# Altium schematic sheet BNO_055_Avionics_board.SchDoc: BNO 055 - Avionics Board
size A4; Author: Adam R. Lehman; SheetNumber: 2; SheetTotal: 5
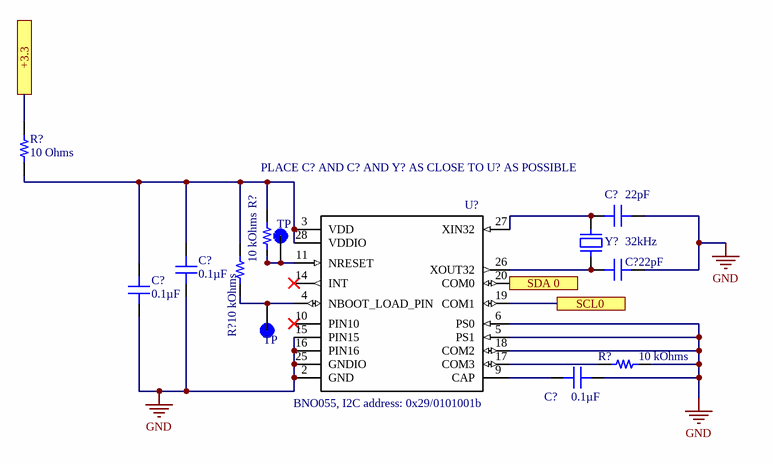
[diagram p0: BNO_055_Avionics_board.SchDoc]

## Parts
(Parts that share a designator on the sheet are numbered #1, #2 ... from top to bottom, then left to right.)
C?#1  22pF  [CAP 0603_1608]
C?#2  0.1µF  [CAP 0603_1608]
C?#3  22pF  [CAP 0603_1608]
C?#4  0.1µF  [CAP 0603_1608]
C?#5  0.1µF  [CAP 0603_1608]
R?#1  10 Ohms  [RES 0603_1608]
R?#2  10 kOhms  [RES 0603_1608]
R?#3  10 kOhms  [RES 0603_1608]
R?#4  10 kOhms  [RES 0603_1608]
TP#1  (no value)  [HARWIN_S2751-46R]
TP#2  (no value)  [HARWIN_S2751-46R]
U?  BNO055, I2C address: 0x29/0101001b  [*LGA28R50P4X10_380X520X100]
Y?  32kHz  [ABRACON ABS25]

## Ports
+3.3, SCL0, SDA 0

## Nets
GND: C?#1.2 C?#2.1 C?#3.1 C?#4.1 C?#5.1 R?#4.1 U?.2(GND) U?.5(PS1) U?.6(PS0) U?.15(PIN15) U?.16(PIN16) U?.18(COM2) U?.25(GNDIO)
+3.3: R?#1.2 ; port +3.3
SCL0: U?.19(COM1) ; port SCL0
SDA 0: U?.20(COM0) ; port SDA 0
NetC?#1_1: C?#1.1 U?.27(XIN32) Y?.1
NetC?#2_2: C?#2.2 C?#4.2 R?#1.1 R?#2.1 R?#3.1 U?.3(VDD) U?.28(VDDIO)
NetC?#3_2: C?#3.2 U?.26(XOUT32) Y?.4
NetC?#5_2: C?#5.2 U?.9(CAP)
NetR?#2_2: R?#2.2 TP#1.1(TP) U?.11(NRESET)
NetR?#3_2: R?#3.2 TP#2.1(TP) U?.4(NBOOT_LOAD_PIN)
NetR?#4_2: R?#4.2 U?.17(COM3)

Not connected (* = marked no-connect by the designer): U? 10(PIN10)* 14(INT)*

## Notes on the sheet
- PLACE C? AND C? AND Y? AS CLOSE TO U? AS POSSIBLE
- Title
- Size:
- Date:
- A4
- Author
- Time:
- Sheet
- Revision:
- of
- RIT Space Exploration Team
- Rochester Institute of Technology
- 1 Lomb Memorial Drive
- Rochester, NY 14623
- https://spex.rit.edu
- File:

## Library data of the parts
C?#1 C?#3 = C0603C220J5GACTU: CAP CER 22PF 50V C0G/NP0 0603; Manufacturer: KEMET; Temperature Coefficient: C0G, NP0; Tolerance: ±5%; Part Number: C0603C220J5GACTU; Value: 22pF; Applications: General Purpose; Capacitance: 22pF; ComponentLink1Description: Datasheet; ComponentLink1URL: https://api.kemet.com/component-edge/download/datasheet/C0603C220J5GACTU.pdf; ComponentLink2Description: DigiKey Link; ComponentLink2URL: http://digikey.com/product-detail/en/kemet/C0603C220J5GACTU/399-1053-1-ND/411328; Device Package: 0603 (1608 Metric); Features: Low ESL; LastUpdated: 1/21/2020 12:02:09 AM; Lifecycle Status: Active; Minimum Order: 1; Mounting Type: Surface Mount, MLCC; Operating Temperature: -55°C ~ 125°C; Package / Case: 0603 (1608 Metric); Packaging: TapeAndReel; PartId: 2302; Part Status: Active; Price: 0.02; Series: SMD Comm C0G; Size / Dimension: 0.063" L x 0.031" W (1.60mm x 0.80mm); Supplier 1: DigiKey; Supplier Part Number 1: 399-1053-1-ND; Thickness (Max): 0.034" (0.87mm); Voltage - Rated: 50V
C?#2 C?#4 C?#5 = 100X14W104MV4T: CAP CER 0.1UF 10V X7R 0603; Manufacturer: Johanson Dielectrics Inc.; Tolerance: ±20%; Part Number: 100X14W104MV4T; Value: 0.1µF; Applications: Bypass, Decoupling; Capacitance: 0.1µF; ComponentLink1Description: Datasheet; ComponentLink1URL: https://www.johansondielectrics.com/downloads/x2y-filter-and-decoupling-capacitors.pdf; ComponentLink2Description: DigiKey Link; ComponentLink2URL: http://digikey.com/product-detail/en/johanson-dielectrics-inc/100X14W104MV4T/709-1101-1-ND/1655915; Device Package: 0603 (1608 Metric); Features: Low ESL (X2Y); LastUpdated: 1/21/2020 12:02:09 AM; Lifecycle Status: Active; Minimum Order: 1; Mounting Type: Surface Mount, MLCC; Operating Temperature: -55°C ~ 125°C; Package / Case: 0603 (1608 Metric); Packaging: TapeAndReel; PartId: 2680; Part Status: Active; Price: 0.11; Series: X2Y®; Size / Dimension: 0.064" L x 0.035" W (1.63mm x 0.89mm); Supplier 1: DigiKey; Supplier Part Number 1: 709-1101-1-ND; Temperature Coefficient: X7R; Thickness (Max): 0.026" (0.66mm); Voltage - Rated: 10V
R?#1 = SG731JTTD100K: SMD RESISTOR; Manufacturer: KOA Speer Electronics, Inc.; Power (Watts): 0.1W, 1/10W; Temperature Coefficient: ±200ppm/°C; Tolerance: ±10%; Part Number: SG731JTTD100K; Value: 10 Ohms; ComponentLink1Description: Datasheet; ComponentLink1URL: http://www.koaspeer.com/catimages/Products/SG73/SG73.pdf; ComponentLink2Description: DigiKey Link; ComponentLink2URL: http://digikey.com/product-detail/en/koa-speer-electronics-inc/SG731JTTD100K/2019-SG731JTTD100KCT-ND/10187255; Composition: Thick Film; Device Package: 0603 (1608 Metric); Features: Automotive AEC-Q200, Moisture Resistant, Pulse Withstanding; Height - Seated (Max): 0.022" (0.55mm); LastUpdated: 1/21/2020 12:19:43 AM; Lifecycle Status: Active; Minimum Order: 1; Number of Terminations: 2; Operating Temperature: -55°C ~ 155°C; Package / Case: 0603 (1608 Metric); Packaging: TapeAndReel; PartId: 17783; Part Status: Active; Price: 0.02; Ratings: AEC-Q200; Resistance: 10 Ohms; Series: SG73; Size / Dimension: 0.063" L x 0.031" W (1.60mm x 0.80mm); Supplier 1: DigiKey; Supplier Part Number 1: 2019-SG731JTTD100KCT-ND; Supplier Device Package: 0603
R?#2-R?#4 = RNCS0603BKE10K0: RES 10K OHM 0.1% 1/16W 0603; Manufacturer: Stackpole Electronics Inc; Power (Watts): 0.063W, 1/16W; Temperature Coefficient: ±25ppm/°C; Part Number: RNCS0603BKE10K0; Value: 10 kOhms; ComponentLink1Description: Datasheet; ComponentLink1URL: https://www.seielect.com/catalog/sei-rncs_rnch.pdf; ComponentLink2Description: DigiKey Link; ComponentLink2URL: http://digikey.com/product-detail/en/stackpole-electronics-inc/RNCS0603BKE10K0/RNCS0603BKE10K0CT-ND/1800113; Composition: Thin Film; Device Package: 0603 (1608 Metric); Features: Anti-Corrosive, Automotive AEC-Q200, Moisture Resistant; Height - Seated (Max): 0.022" (0.55mm); LastUpdated: 1/21/2020 12:25:01 AM; Lifecycle Status: Active; Minimum Order: 1; Number of Terminations: 2; Operating Temperature: -55°C ~ 155°C; Package / Case: 0603 (1608 Metric); Packaging: TapeAndReel; PartId: 4838; Part Status: Active; Price: 0.08; Ratings: AEC-Q200; Resistance: 10 kOhms; Series: RNCS; Size / Dimension: 0.061" L x 0.031" W (1.55mm x 0.80mm); Supplier 1: DigiKey; Supplier Part Number 1: RNCS0603BKE10K0CT-ND; Supplier Device Package: 0603; Tolerance: ±0.1%
TP#1 TP#2 = S2751-46R: Natural PC Test Point Brass, Tin Plating Surface Mount Mounting Type; MF: Harwin Inc.; Package: DIP-64 Harwin; SnapEDA_Link: https://www.snapeda.com/parts/S2751-46R/Harwin%20Inc./view-part/602614/?ref=snap; MP: S2751-46R; Value: *
U? = BNO055: / Accelerometer, Gyroscope, Magnetometer, 9 Axis Sensor IÂ²C, UART Output /; MF: Bosch; Package: LGA-28 Bosch; Digi-Key_Part_Number: 828-1058-1-ND; Digi-Key_Purchase_URL: https://www.digikey.com/product-detail/en/bosch-sensortec/BNO055/828-1058-1-ND/6136309?utm_source=snapeda&utm_medium=aggregator&utm_campaign=symbol; MP: BNO055; SnapEDA_Link: https://www.snapeda.com/parts/BNO055/Bosch%20Sensortec/view-part/51961/?ref=snap; Value: *
Y? = ABS25-32.000KHZ-T: CRYSTAL 32.0000KHZ 12.5PF SMD; Manufacturer: Abracon LLC; ESR (Equivalent Series Resistance): 50 kOhms; Frequency Tolerance: ±30ppm; Operating Mode: Fundamental; Part Number: ABS25-32.000KHZ-T; ComponentLink1Description: Datasheet; ComponentLink1URL: https://abracon.com/Resonators/abs25.pdf; ComponentLink2Description: DigiKey Link; ComponentLink2URL: http://digikey.com/product-detail/en/abracon-llc/ABS25-32.000KHZ-T/535-10242-1-ND/2218055; Device Package: 4-SOJ, 5.50mm pitch; Frequency: 32kHz; Height - Seated (Max): 0.098" (2.50mm); LastUpdated: 1/21/2020 3:21:21 AM; Lifecycle Status: Active; Load Capacitance: 12.5pF; Minimum Order: 1; Mounting Type: Surface Mount; Operating Temperature: -40°C ~ 85°C; Package / Case: 4-SOJ, 5.50mm pitch; Packaging: TapeAndReel; PartId: 398; Part Status: Active; Price: 0.71; Series: ABS25; Size / Dimension: 0.315" L x 0.150" W (8.00mm x 3.80mm); Supplier 1: DigiKey; Supplier Part Number 1: 535-10242-1-ND; Type: kHz Crystal (Tuning Fork); Value: 32kHz